# Altium schematic sheet scehm.SchDoc
size A3; SheetNumber: 5; SheetTotal: 5
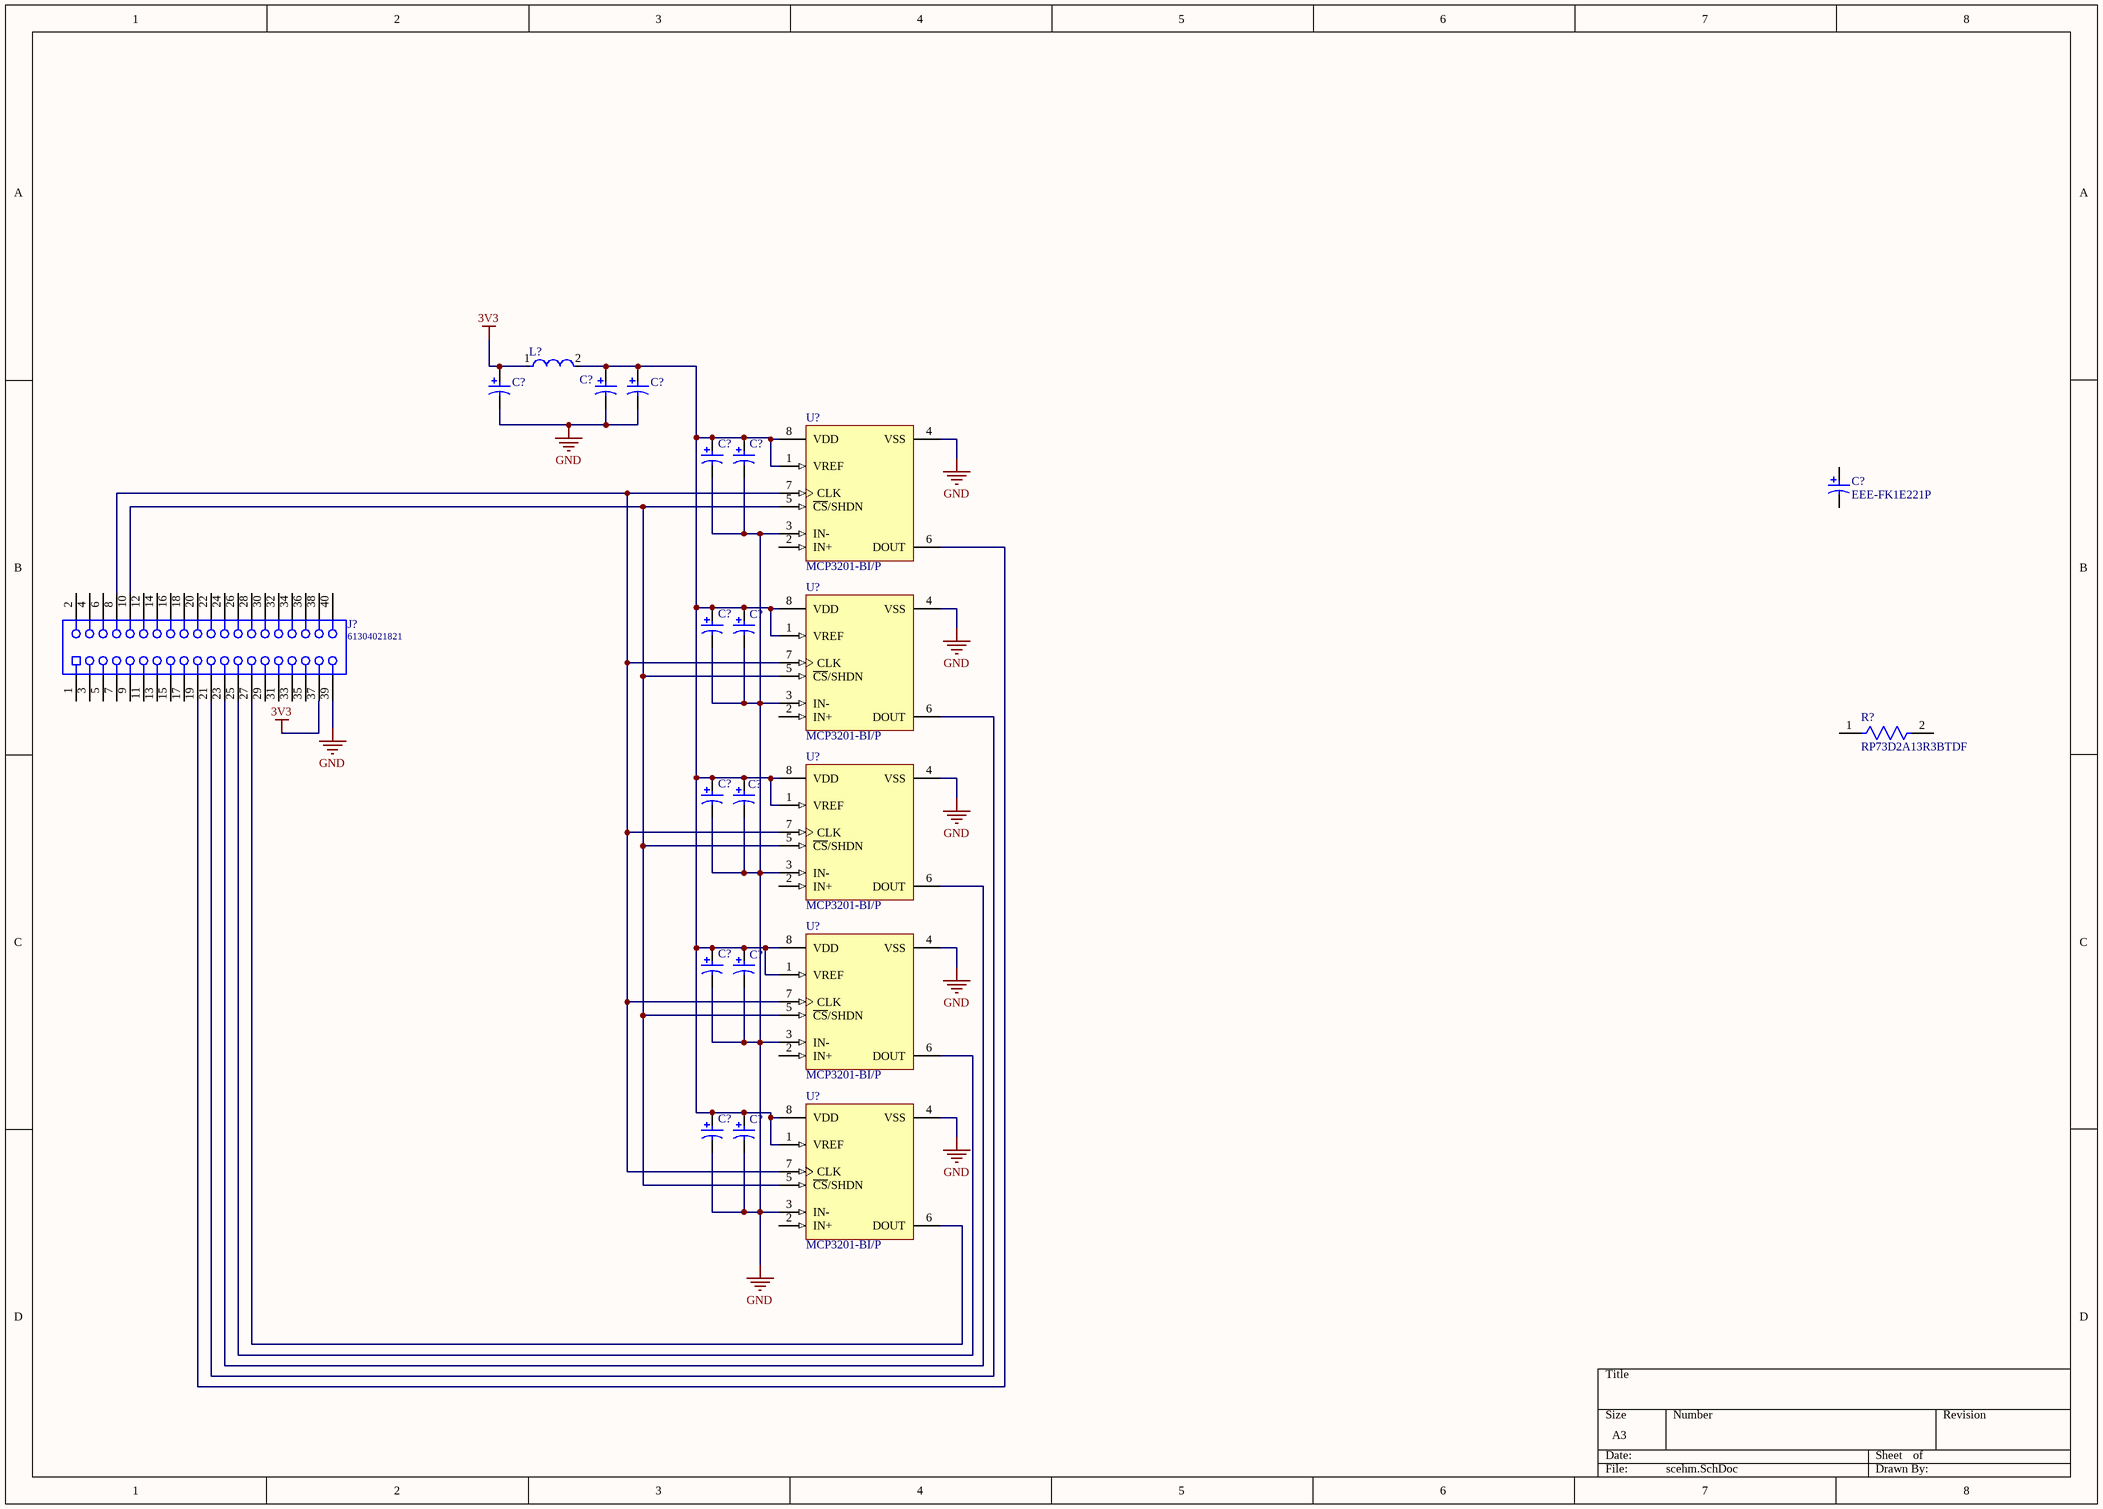
[diagram p0: scehm.SchDoc]

## Parts
(Parts that share a designator on the sheet are numbered #1, #2 ... from top to bottom, then left to right.)
C?#1  EEE-FK1E221P  [PNSC-EEE-FK1E221P_N]  (value not drawn)
C?#2  EEE-FK1E221P  [PNSC-EEE-FK1E221P_N]  (value not drawn)
C?#3  EEE-FK1E221P  [PNSC-EEE-FK1E221P_N]  (value not drawn)
C?#4  EEE-FK1E221P  [PNSC-EEE-FK1E221P_N]  (value not drawn)
C?#5  EEE-FK1E221P  [PNSC-EEE-FK1E221P_N]  (value not drawn)
C?#6  EEE-FK1E221P  [PNSC-EEE-FK1E221P_N]
C?#7  EEE-FK1E221P  [PNSC-EEE-FK1E221P_N]  (value not drawn)
C?#8  EEE-FK1E221P  [PNSC-EEE-FK1E221P_N]  (value not drawn)
C?#9  EEE-FK1E221P  [PNSC-EEE-FK1E221P_N]  (value not drawn)
C?#10  EEE-FK1E221P  [PNSC-EEE-FK1E221P_N]  (value not drawn)
C?#11  EEE-FK1E221P  [PNSC-EEE-FK1E221P_N]  (value not drawn)
C?#12  EEE-FK1E221P  [PNSC-EEE-FK1E221P_N]  (value not drawn)
C?#13  EEE-FK1E221P  [PNSC-EEE-FK1E221P_N]  (value not drawn)
C?#14  EEE-FK1E221P  [PNSC-EEE-FK1E221P_N]  (value not drawn)
J?  61304021821  [61304021821]
L?  B82422A1103K100  [FP-B82422A-MFG]  (value not drawn)
R?  RP73D2A13R3BTDF  [FP-RP732A-IPC_A]
U?#1  MCP3201-BI/P  [PDIP300-P8]
U?#2  MCP3201-BI/P  [PDIP300-P8]
U?#3  MCP3201-BI/P  [PDIP300-P8]
U?#4  MCP3201-BI/P  [PDIP300-P8]
U?#5  MCP3201-BI/P  [PDIP300-P8]

## Nets
3V3: C?#1.1 J?.37 L?.1
GND: C?#1.2 C?#2.2 C?#3.2 C?#4.2 C?#5.2 C?#7.2 C?#8.2 C?#9.2 C?#10.2 C?#11.2 C?#12.2 C?#13.2 C?#14.2 J?.39 U?#1.3(IN-) U?#1.4(VSS) U?#2.3(IN-) U?#2.4(VSS) U?#3.3(IN-) U?#3.4(VSS) U?#4.3(IN-) U?#4.4(VSS) U?#5.3(IN-) U?#5.4(VSS)
NetC?#2_1: C?#2.1 C?#3.1 C?#4.1 C?#5.1 C?#7.1 C?#8.1 C?#9.1 C?#10.1 C?#11.1 C?#12.1 C?#13.1 C?#14.1 L?.2 U?#1.1(VREF) U?#1.8(VDD) U?#2.1(VREF) U?#2.8(VDD) U?#3.1(VREF) U?#3.8(VDD) U?#4.1(VREF) U?#4.8(VDD) U?#5.1(VREF) U?#5.8(VDD)
NetJ?_8: J?.8 U?#1.7(CLK) U?#2.7(CLK) U?#3.7(CLK) U?#4.7(CLK) U?#5.7(CLK)
NetJ?_10: J?.10 U?#1.5(~{CS}/SHDN) U?#2.5(~{CS}/SHDN) U?#3.5(~{CS}/SHDN) U?#4.5(~{CS}/SHDN) U?#5.5(~{CS}/SHDN)
NetJ?_19: J?.19 U?#1.6(DOUT)
NetJ?_21: J?.21 U?#2.6(DOUT)
NetJ?_23: J?.23 U?#3.6(DOUT)
NetJ?_25: J?.25 U?#4.6(DOUT)
NetJ?_27: J?.27 U?#5.6(DOUT)

Not connected (* = marked no-connect by the designer): C?#6 1 2; J? 1 2 3 4 5 6 7 9 11 12 13 14 15 16 17 18 20 22 24 26 28 29 30 31 32 33 34 35 36 38 40; R? 1 2; U?#1 2(IN+); U?#2 2(IN+); U?#3 2(IN+); U?#4 2(IN+); U?#5 2(IN+)

## Library data of the parts
C?#1-C?#14 = CMP-1665-00017-3: Aluminum Electrolytic Capacitor, 220 uF, +/- 20%, 25 V, -55 to 105 degC, 2-Pin CAPAE, RoHS, Tape and Reel; Manufacturer: Panasonic; Voltage Rating: 25 V; ComponentLink2URL: http://industrial.panasonic.com/cdbs/www-data/pdf/RDE0000/ABA0000C1181.pdf; Height: 10.2 mm; Max Operating Temperature: 105 degC; PackageReference: EEE-FK1E221P; ComponentLink1Description: Manufacturer URL; ComponentLink1URL: http://www.panasonic.com/; Mount: Surface Mount; REACH SVHC: No SVHC; Min Operating Temperature: -55 degC; ComponentLink2Description: Datasheet; DatasheetVersion: 03/2016; Length: 10.2 mm; RoHSCompliant: true; Packaging: Tape and Reel; Package Quantity: 500; Lead Pitch: 3.1 mm; Pins: 2; PackageDescription: 2-Pin Electrolytic Aluminum Capacitor, Body 8.3 x 8.3 mm; Mounting Technology: Surface Mount
J? = CMP-1502-01370-1: THT Vertical Socket Header WR-PHD, Pitch 2.54 mm, Dual Row, 40 pins; Manufacturer: Wurth Elektronik; Pitch: 2.54mm; Withstanding Voltage: 500VAC; Rated Current: 3A; Gender: Female; Working Voltage: 250VAC; Pin Number: 40; Contact Resistance: 20mOhm; Datasheet URL: https://katalog.we-online.de/em/datasheet/6130xx21821.pdf; Operating Temperature: -40to125degC; Row Number: Dual; Mounting Technology: THT; Package Reference: 61304021821; Orientation: Vertical; Part Number: 61304021821; Manufacturer URL: http://www.we-online.de; Publisher: WurthElektronik; Packaging: Tray
L? = CMP-2000-05912-2: FIXED IND 10UH 180MA 1.6 OHM SMD; Tolerance: 10%; Core Material: Ferrite; Q Factor: 27; Self Resonant Frequency: 25MHz; Shielding: Unshielded; Test Frequency: 1MHz; Series Resistance: 1.6R; Radiation Hardening: No; REACH SVHC: No SVHC; Width: 0.098inch; RoHS Compliant: Yes; Case/Package: 1210; DC Current: 180mA; Package Quantity: 2000; Height - Seated (Max): 0.083inch; Rated Current-Max: 180mA; Series: SIMID; Mount: Surface Mount; Depth: 2.8mm; Resistor Type: Wirewound; Max DC Current: 180mA; Termination: SMD/SMT; Contact Plating: Tin; Height: 2.1mm; Inductance: 10uH; Case Code (Metric): 3225; Lead Free: Lead Free; Weight: 0.001764oz; Max Operating Temperature: 125°C; Length: 3.5mm; Packaging: Tape and Reel; Case Code (Imperial): 1210; Inductance Tolerance: 10%; Ratings: AEC-Q200; Number of Pins: 2; Current Rating: 180mA; Military Standard: Not; DC Resistance (DCR): 1.6R
R? = CMP-03211-010501-2: Surface Mount Resistors, Precision Resistor, 2 Terminations, Size Code 0805, Cut Tape Length, .1%, Thin Film, 10K 0.1% 10PPM; Power Rating: 125mW; Number of Resistors: 1; Resistance: 13.3R; Temperature Coefficient: 15ppm/°C; Voltage Rating: 150V; Mount: Surface Mount; Case/Package: 0805; Max Operating Temperature: 155°C; Packaging: Tape and Reel; Length: 2mm; Weight: 0.000194oz; Width: 1.25mm; Case Code (Imperial): 0805; Tolerance: 0.1%; Height: 0.55mm; ELV: Compliant; Case Code (Metric): 2012; Termination: Solder; Number of Terminations: 2; Package Quantity: 1000; Min Operating Temperature: -55°C
U?#1-U?#5 = CMP-0188-00242-2: 2.7V 12-Bit A/D Converter with SPI Serial Interface, 8-Pin PDIP, B Performance Grade, Industrial Temperature; DatasheetVersion: revF, Aug-2011; ComponentLink3URL: http://www.microchip.com/stellent/groups/techpub_sg/documents/packagingspec/en012702.pdf; RevisionNote: URLs added. DatasheetVersion updated.; Code_JEDEC: MS-001; ComponentLink2Description: Datasheet; ComponentLink3Description: Package Specification; ComponentLink1URL: http://www.microchip.com/; PackageDescription: 8-Lead Plastic Dual In-Line (P) - 300 mil Body [PDIP]; ComponentLink2URL: http://ww1.microchip.com/downloads/en/DeviceDoc/21290F.pdf; PackageVersion: revBB, Aug-2009; PackageReference: PDIP300-P8; ComponentLink1Description: Manufacturer URL